# EAGLE schematic lrdboard_358v1 (EAGLE 6.3)
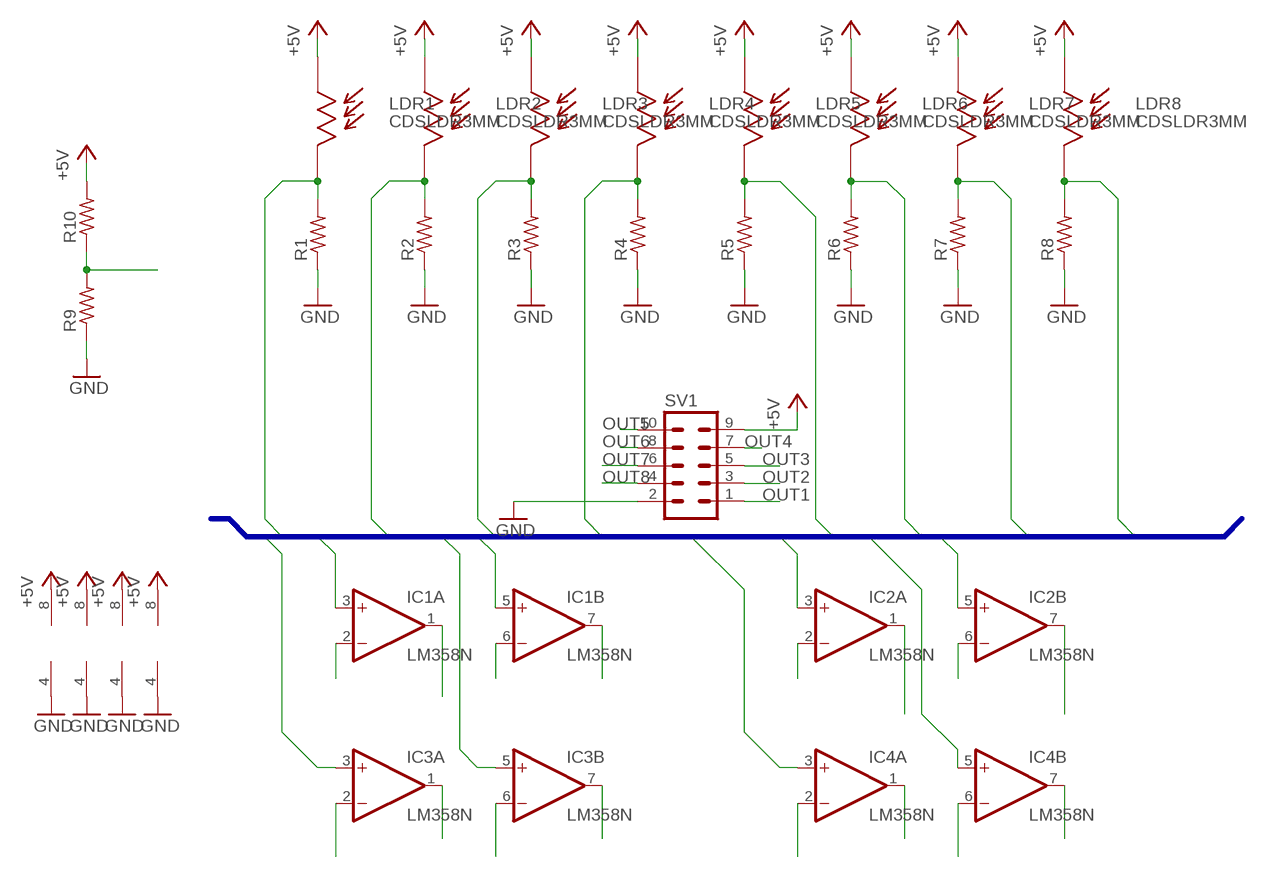
[diagram p0: schematic, sheet 1]

## Parts
IC1  LM358N  [DIL08]
IC2  LM358N  [DIL08]
IC3  LM358N  [DIL08]
IC4  LM358N  [DIL08]
LDR1  CDSLDR3MM  [LDR3MM]
LDR2  CDSLDR3MM  [LDR3MM]
LDR3  CDSLDR3MM  [LDR3MM]
LDR4  CDSLDR3MM  [LDR3MM]
LDR5  CDSLDR3MM  [LDR3MM]
LDR6  CDSLDR3MM  [LDR3MM]
LDR7  CDSLDR3MM  [LDR3MM]
LDR8  CDSLDR3MM  [LDR3MM]
R1  RESISTOR0207/10  [0207/10]
R2  RESISTOR0207/10  [0207/10]
R3  RESISTOR0207/10  [0207/10]
R4  RESISTOR0207/10  [0207/10]
R5  RESISTOR0207/10  [0207/10]
R6  RESISTOR0207/10  [0207/10]
R7  RESISTOR0207/10  [0207/10]
R8  RESISTOR0207/10  [0207/10]
R9  RESISTOR0207/10  [0207/10]
R10  RESISTOR0207/10  [0207/10]
SV1  MA05-2  [MA05-2]

## Nets
1: IC1.3(A:+IN) LDR1.P$2 R1.2
2: IC1.5(B:+IN) LDR2.P$2 R2.2
3: IC2.3(A:+IN) LDR3.P$2 R3.2
4: IC2.5(B:+IN) LDR4.P$2 R4.2
5: IC3.3(A:+IN) LDR5.P$2 R5.2
6: IC3.5(B:+IN) LDR6.P$2 R6.2
7: IC4.3(A:+IN) LDR7.P$2 R7.2
8: IC4.5(B:+IN) LDR8.P$2 R8.2
+5V: IC1.8(P:V+) IC2.8(P:V+) IC3.8(P:V+) IC4.8(P:V+) LDR1.P$1 LDR2.P$1 LDR3.P$1 LDR4.P$1 LDR5.P$1 LDR6.P$1 LDR7.P$1 LDR8.P$1 R10.2 SV1.9
GND: IC1.4(P:V-) IC2.4(P:V-) IC3.4(P:V-) IC4.4(P:V-) R1.1 R2.1 R3.1 R4.1 R5.1 R6.1 R7.1 R8.1 R9.1 SV1.2
MID: IC1.2(A:-IN) IC1.6(B:-IN) IC2.2(A:-IN) IC2.6(B:-IN) IC3.2(A:-IN) IC3.6(B:-IN) IC4.2(A:-IN) IC4.6(B:-IN) R9.2 R10.1
OUT1: IC1.1(A:OUT) SV1.1
OUT2: IC1.7(B:OUT) SV1.3
OUT3: IC2.1(A:OUT) SV1.5
OUT4: IC2.7(B:OUT) SV1.7
OUT5: IC3.1(A:OUT) SV1.10
OUT6: IC3.7(B:OUT) SV1.8
OUT7: IC4.1(A:OUT) SV1.6
OUT8: IC4.7(B:OUT) SV1.4

## Buses
1,2,3,4,5,6,7,8

## Library data of the parts
IC1-IC4 = CEDTv69:LM358: OP AMP also LM158; LM258; LM2904 Source: http://cache.national.com/ds/LM/LM158.pdf
LDR1-LDR8 = CEDTv69:CDSLDR3MM
R1-R10 = CEDTv69:RESISTOR
SV1 = con-lstb:MA05-2: PIN HEADER; OC_FARNELL: unknown; OC_NEWARK: unknown